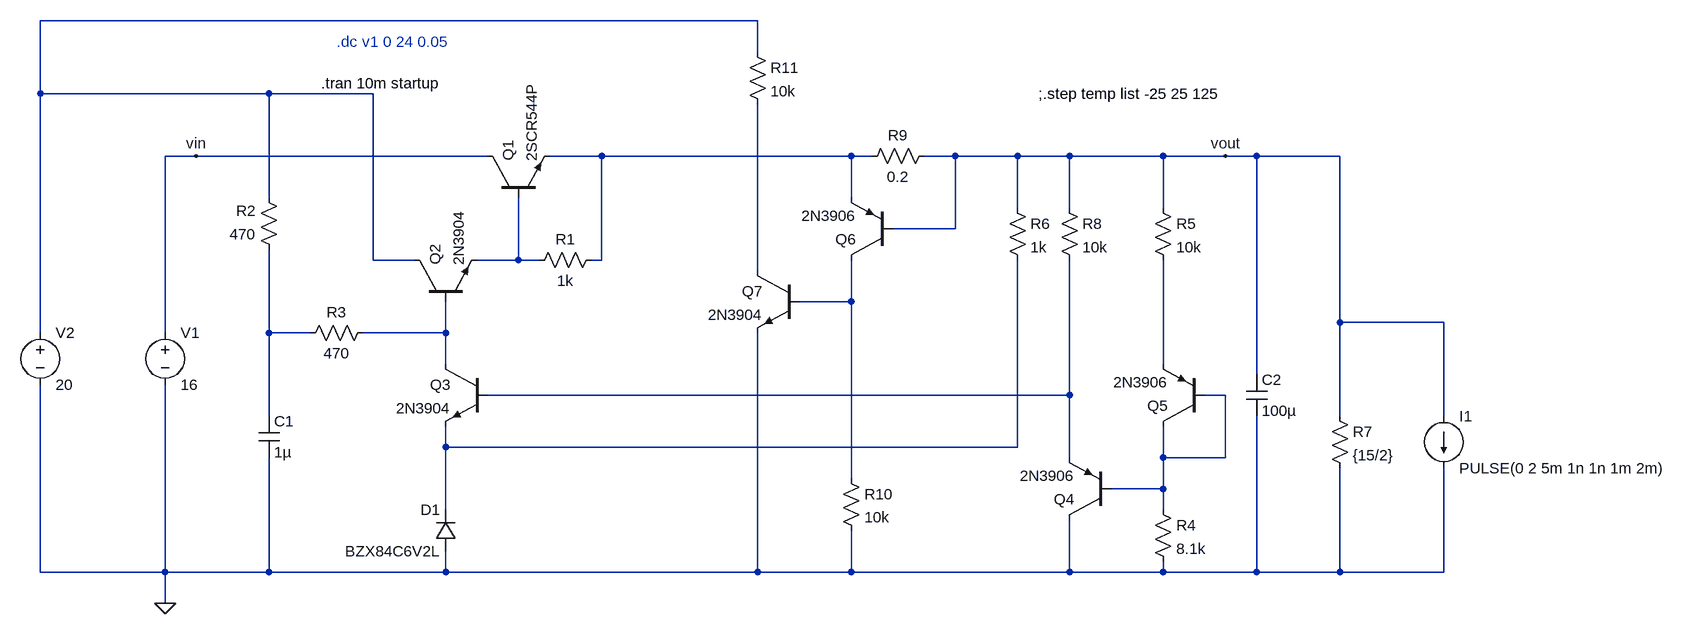
[diagram p0: schematic linear_regulator1.asc]
linear_regulator1.asc, the LTspice schematic file:
Version 4.1
SHEET 1 2028 724
WIRE 608 -192 -496 -192
WIRE 608 -144 608 -192
WIRE -496 -80 -496 -192
WIRE -144 -80 -496 -80
WIRE 16 -80 -144 -80
WIRE -256 16 -304 16
WIRE 192 16 -256 16
WIRE 368 16 288 16
WIRE 752 16 368 16
WIRE 784 16 752 16
WIRE 912 16 864 16
WIRE 1008 16 912 16
WIRE 1088 16 1008 16
WIRE 1232 16 1088 16
WIRE 1328 16 1232 16
WIRE 1376 16 1328 16
WIRE 1504 16 1376 16
WIRE -144 80 -144 -80
WIRE 752 80 752 16
WIRE 1008 96 1008 16
WIRE 1088 96 1088 16
WIRE 1232 96 1232 16
WIRE 912 128 912 16
WIRE 912 128 816 128
WIRE 16 176 16 -80
WIRE 80 176 16 176
WIRE 240 176 240 80
WIRE 240 176 176 176
WIRE 272 176 240 176
WIRE 368 176 368 16
WIRE 368 176 352 176
WIRE 608 192 608 -64
WIRE 752 240 752 176
WIRE 752 240 672 240
WIRE 1504 272 1504 16
WIRE 1664 272 1504 272
WIRE -496 288 -496 -80
WIRE -304 288 -304 16
WIRE -144 288 -144 160
WIRE -80 288 -144 288
WIRE 128 288 128 240
WIRE 128 288 0 288
WIRE 128 336 128 288
WIRE 1232 336 1232 176
WIRE 1376 352 1376 16
WIRE 1088 384 1088 176
WIRE 1088 384 192 384
WIRE 1328 384 1296 384
WIRE -144 416 -144 288
WIRE 1504 416 1504 272
WIRE 1664 416 1664 272
WIRE 128 464 128 432
WIRE 1008 464 1008 176
WIRE 1008 464 128 464
WIRE 1088 480 1088 384
WIRE 1232 480 1232 432
WIRE 1328 480 1328 384
WIRE 1328 480 1232 480
WIRE 752 512 752 240
WIRE 1232 528 1232 480
WIRE 1232 528 1152 528
WIRE 128 560 128 464
WIRE 1232 560 1232 528
WIRE -496 656 -496 368
WIRE -304 656 -304 368
WIRE -304 656 -496 656
WIRE -144 656 -144 480
WIRE -144 656 -304 656
WIRE 128 656 128 624
WIRE 128 656 -144 656
WIRE 608 656 608 288
WIRE 608 656 128 656
WIRE 752 656 752 592
WIRE 752 656 608 656
WIRE 1088 656 1088 576
WIRE 1088 656 752 656
WIRE 1232 656 1232 640
WIRE 1232 656 1088 656
WIRE 1376 656 1376 416
WIRE 1376 656 1232 656
WIRE 1504 656 1504 496
WIRE 1504 656 1376 656
WIRE 1664 656 1664 496
WIRE 1664 656 1504 656
WIRE -304 704 -304 656
FLAG -304 704 0
FLAG -256 16 vin
FLAG 1328 16 vout
SYMBOL npn 192 80 R270
SYMATTR InstName Q1
SYMATTR Value 2SCR544P
SYMBOL npn 80 240 R270
SYMATTR InstName Q2
SYMATTR Value 2N3904
SYMBOL npn 192 336 M0
SYMATTR InstName Q3
SYMATTR Value 2N3904
SYMBOL res 368 160 R90
WINDOW 0 0 56 VBottom 2
WINDOW 3 32 56 VTop 2
SYMATTR InstName R1
SYMATTR Value 1k
SYMBOL res -128 176 R180
WINDOW 0 36 76 Left 2
WINDOW 3 36 40 Left 2
SYMATTR InstName R2
SYMATTR Value 470
SYMBOL res -96 304 R270
WINDOW 0 32 56 VTop 2
WINDOW 3 0 56 VBottom 2
SYMATTR InstName R3
SYMATTR Value 470
SYMBOL res 1216 544 R0
SYMATTR InstName R4
SYMATTR Value 8.1k
SYMBOL res 1216 80 R0
SYMATTR InstName R5
SYMATTR Value 10k
SYMBOL res 992 80 R0
SYMATTR InstName R6
SYMATTR Value 1k
SYMBOL diode 144 624 R180
WINDOW 0 24 64 Left 2
WINDOW 3 24 0 Left 2
SYMATTR InstName D1
SYMATTR Value BZX84C6V2L
SYMBOL cap -160 416 R0
SYMATTR InstName C1
SYMATTR Value 1µ
SYMBOL cap 1360 352 R0
SYMATTR InstName C2
SYMATTR Value 100µ
SYMBOL voltage -304 272 R0
SYMATTR InstName V1
SYMATTR Value 16
SYMBOL res 1488 400 R0
SYMATTR InstName R7
SYMATTR Value {15/2}
SYMBOL pnp 1152 576 R180
SYMATTR InstName Q4
SYMATTR Value 2N3906
SYMBOL res 1072 80 R0
SYMATTR InstName R8
SYMATTR Value 10k
SYMBOL pnp 1296 432 R180
SYMATTR InstName Q5
SYMATTR Value 2N3906
SYMBOL current 1664 416 R0
WINDOW 123 0 0 Left 0
WINDOW 39 0 0 Left 0
SYMATTR InstName I1
SYMATTR Value PULSE(0 2 5m 1n 1n 1m 2m)
SYMBOL voltage -496 272 R0
WINDOW 123 0 0 Left 0
WINDOW 39 0 0 Left 0
SYMATTR InstName V2
SYMATTR Value 20
SYMBOL res 880 0 R90
WINDOW 0 0 56 VBottom 2
WINDOW 3 32 56 VTop 2
SYMATTR InstName R9
SYMATTR Value 0.2
SYMBOL pnp 816 176 R180
SYMATTR InstName Q6
SYMATTR Value 2N3906
SYMBOL res 736 496 R0
SYMATTR InstName R10
SYMATTR Value 10k
SYMBOL npn 672 192 M0
SYMATTR InstName Q7
SYMATTR Value 2N3904
SYMBOL res 592 -160 R0
SYMATTR InstName R11
SYMATTR Value 10k
TEXT -64 -96 Left 2 !.tran 10m startup
TEXT 1040 -80 Left 2 !;.step temp list -25 25 125
TEXT -40 -160 Left 2 ;.dc v1 0 24 0.05

The netlist it stands for:
* linear_regulator1.asc
Q1 vin N003 N002 0 2SCR544P
Q2 N001 N007 N003 0 2N3904
Q3 N007 N009 N011 0 2N3904
R1 N002 N003 1k
R2 N006 N001 470
R3 N006 N007 470
R4 N010 0 8.1k
R5 vout N008 10k
R6 vout N011 1k
D1 0 N011 BZX84C6V2L
C1 N006 0 1µ
C2 vout 0 100µ
V1 vin 0 16
R7 vout 0 {15/2}
Q4 0 N010 N009 0 2N3906
R8 vout N009 10k
Q5 N010 N010 N008 0 2N3906
I1 vout 0 PULSE(0 2 5m 1n 1n 1m 2m)
V2 N001 0 20
R9 vout N002 0.2
Q6 N005 vout N002 0 2N3906
R10 N005 0 10k
Q7 N004 N005 0 0 2N3904
R11 N001 N004 10k
.model D D
.lib standard.dio
.model NPN NPN
.model PNP PNP
.lib standard.bjt
.tran 10m startup
;.step temp list -25 25 125
* .dc v1 0 24 0.05
.backanno
.end